# EAGLE board Electronica_4K1 (EAGLE 9.6.2)
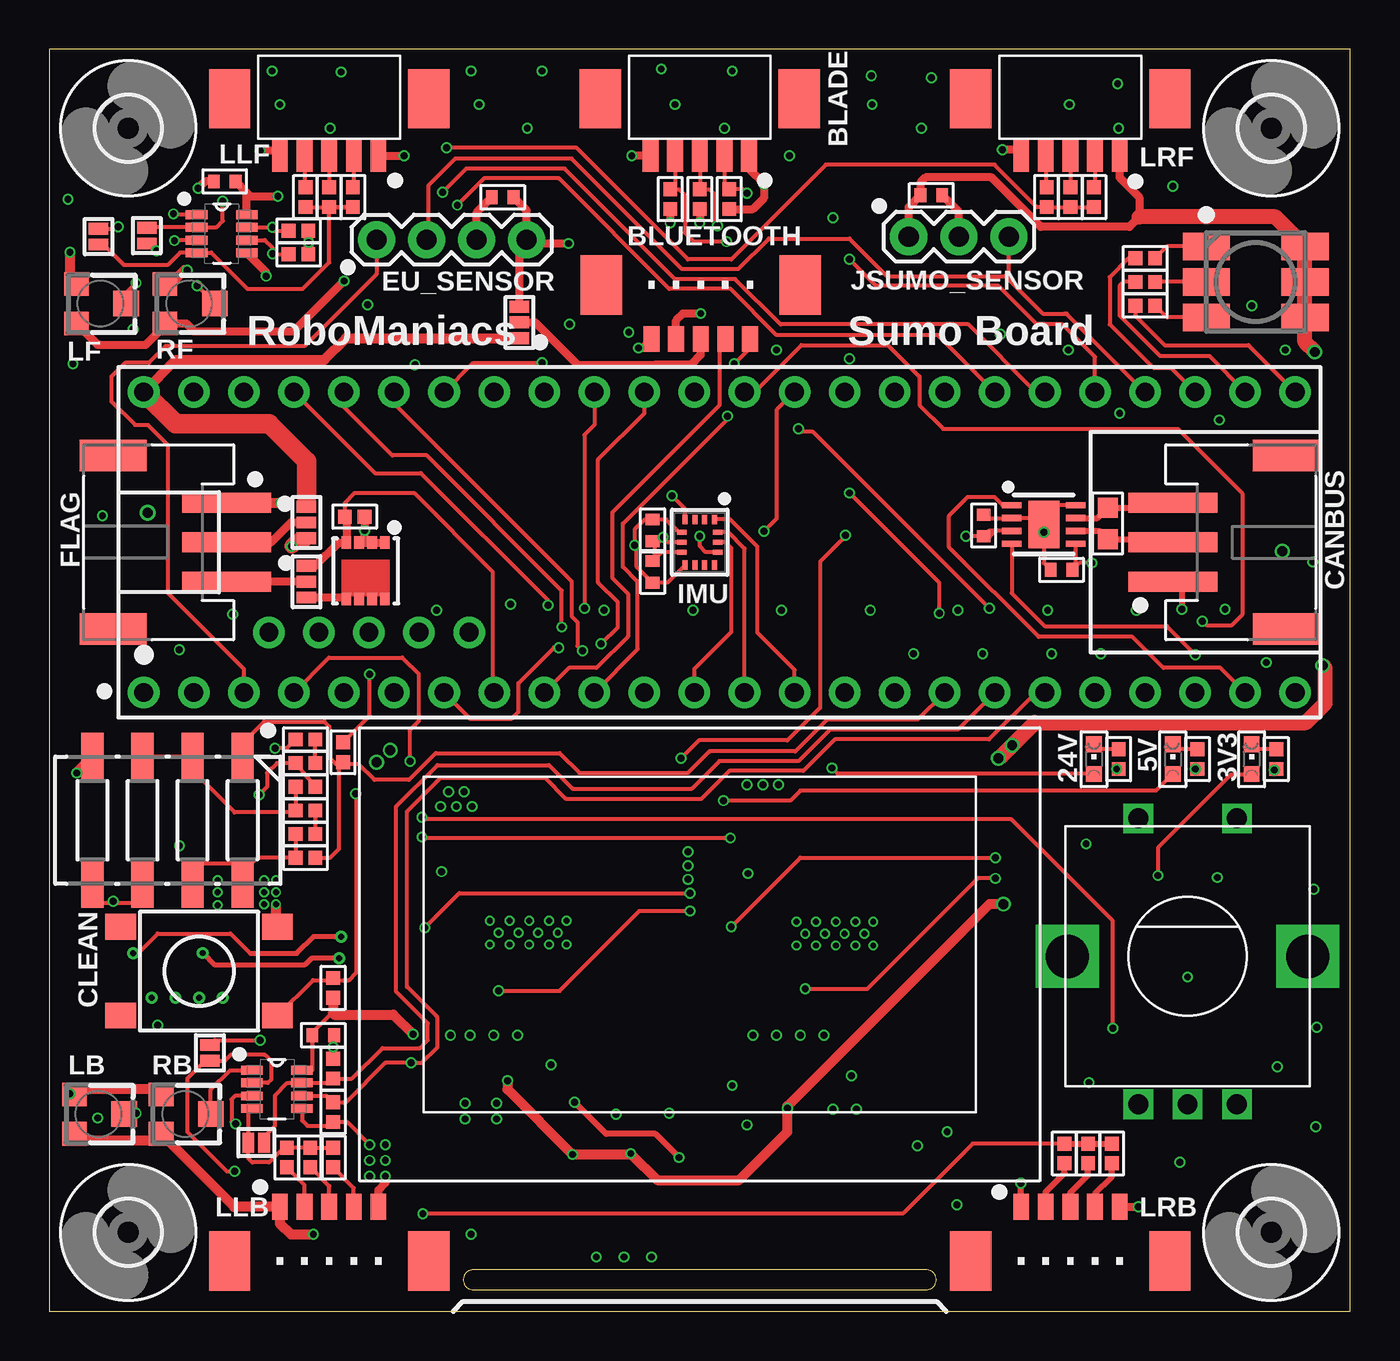
[diagram p5: board, top side]
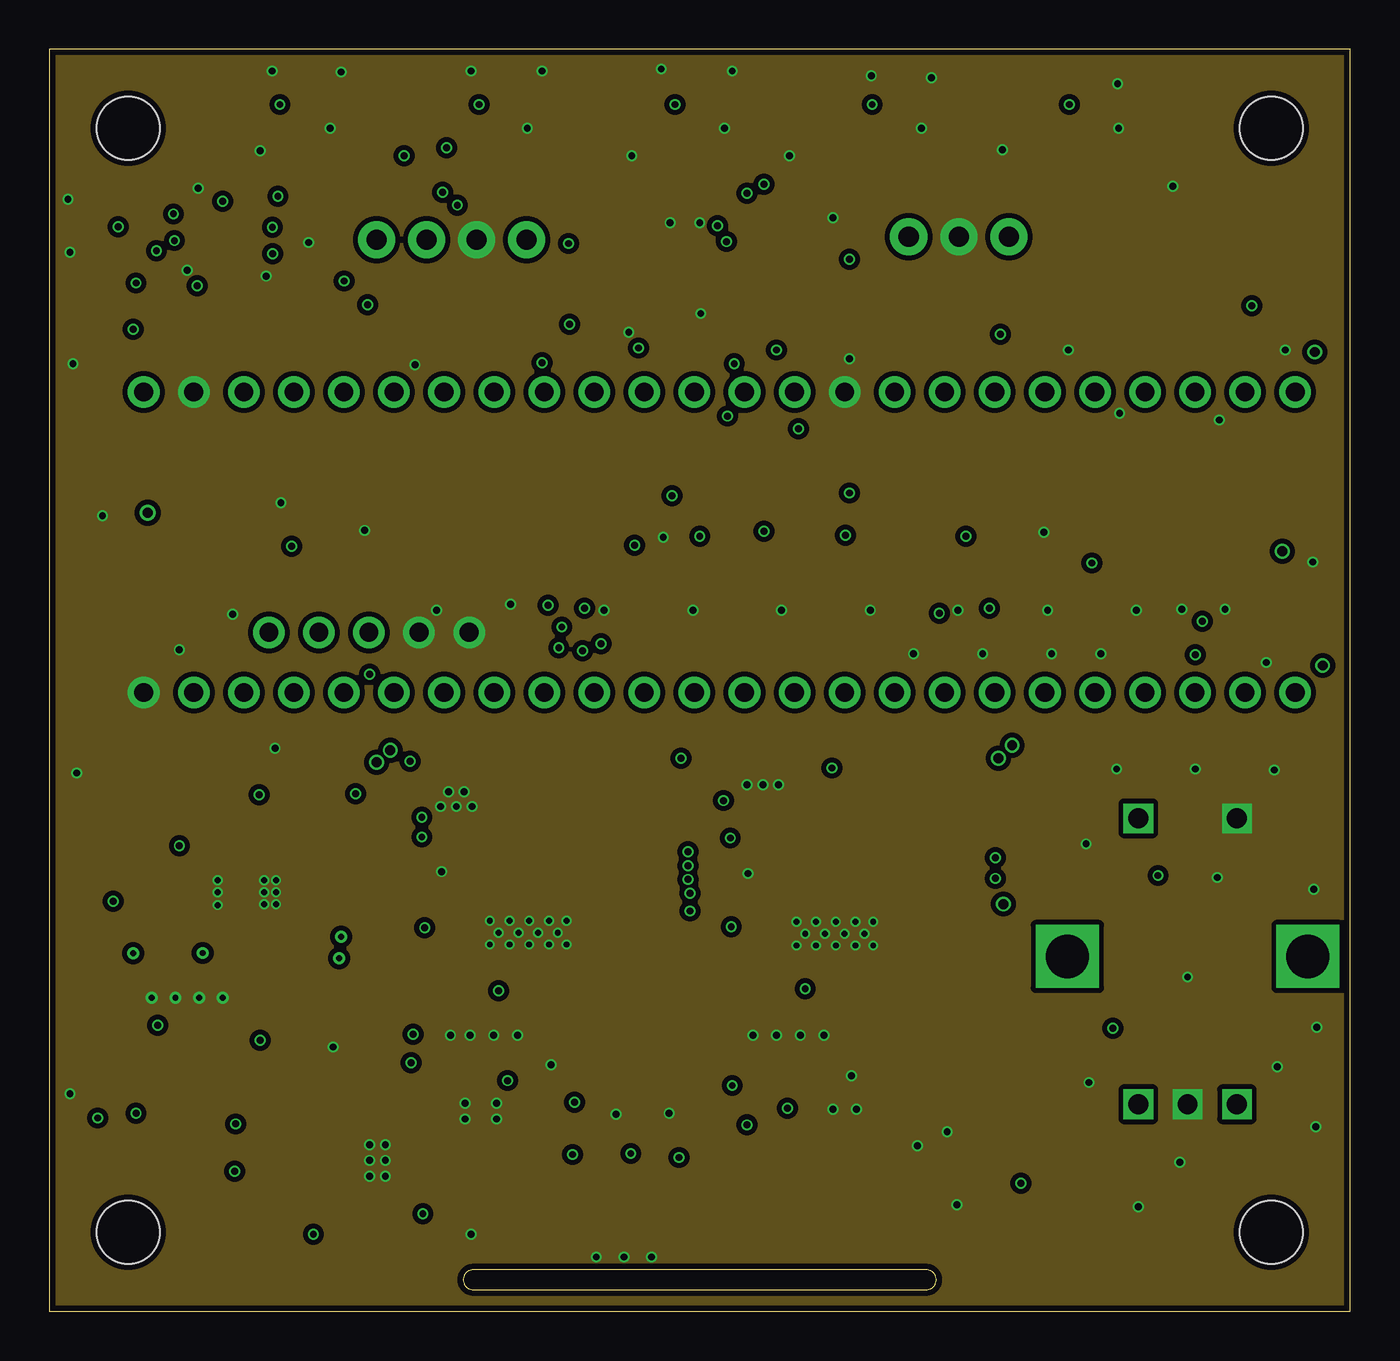
[diagram p6: board, inner layer Route2]
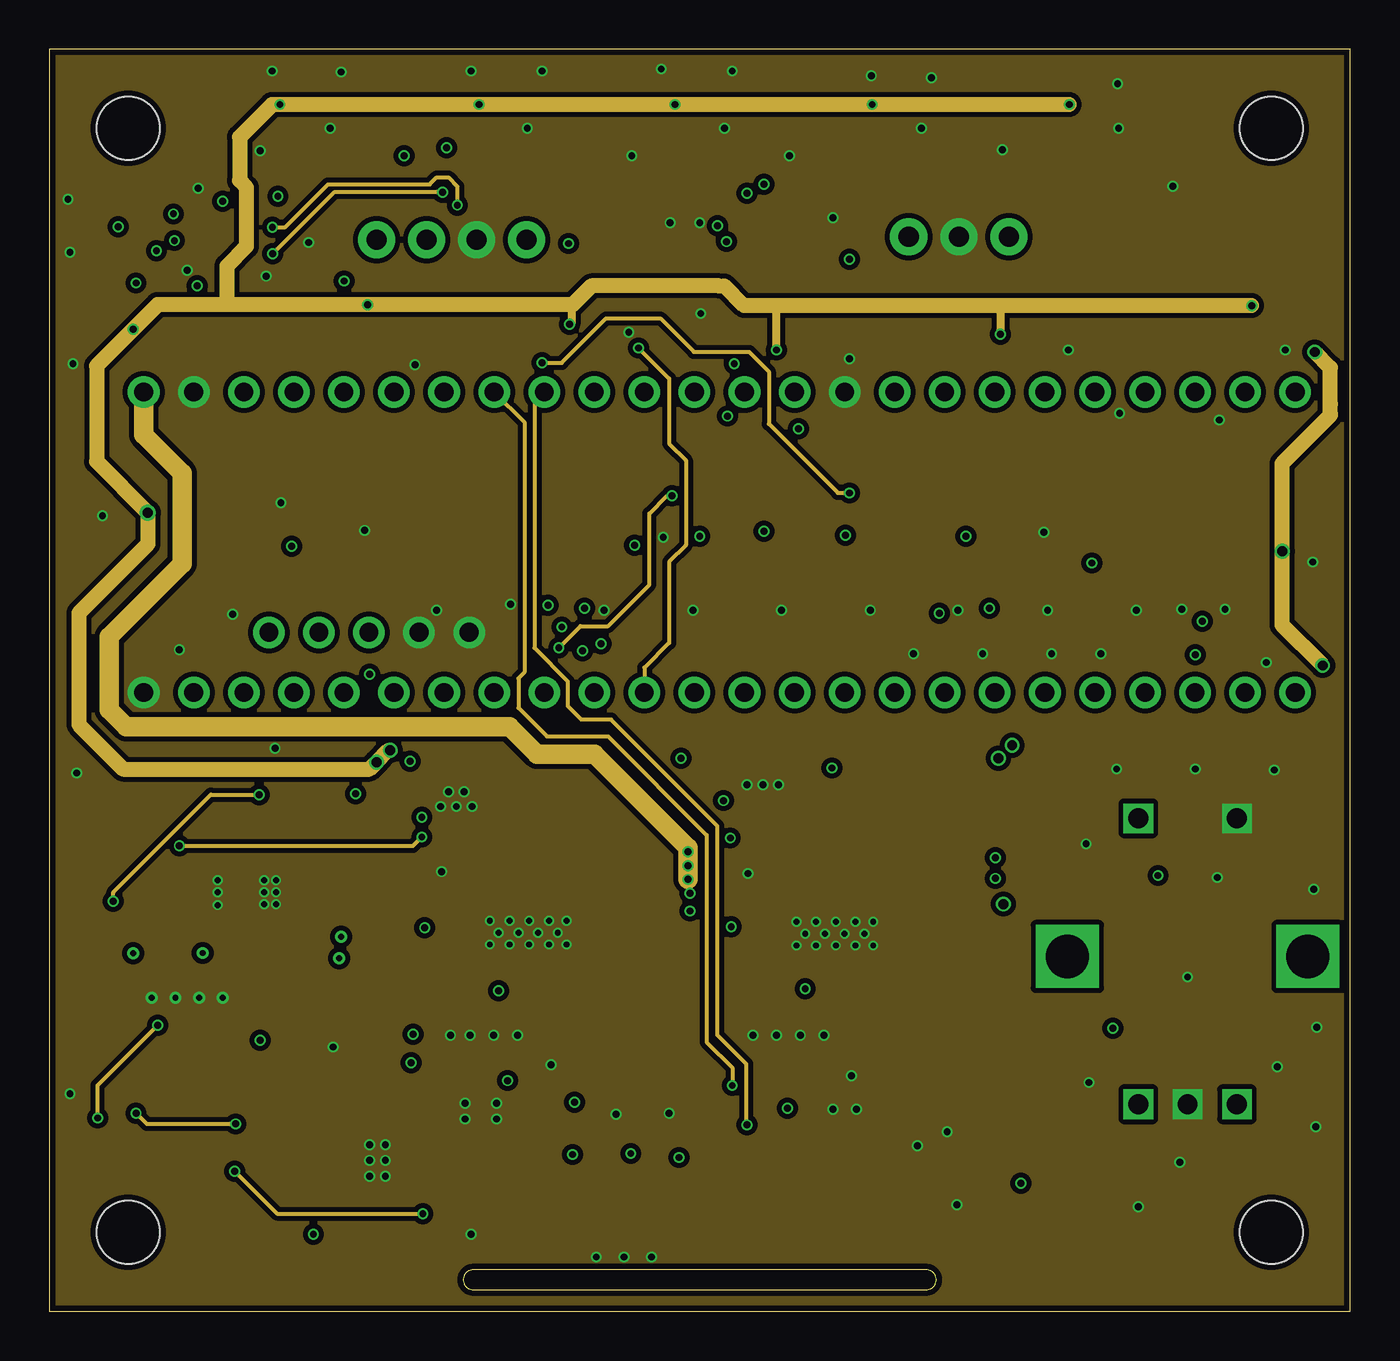
[diagram p7: board, inner layer Route15]
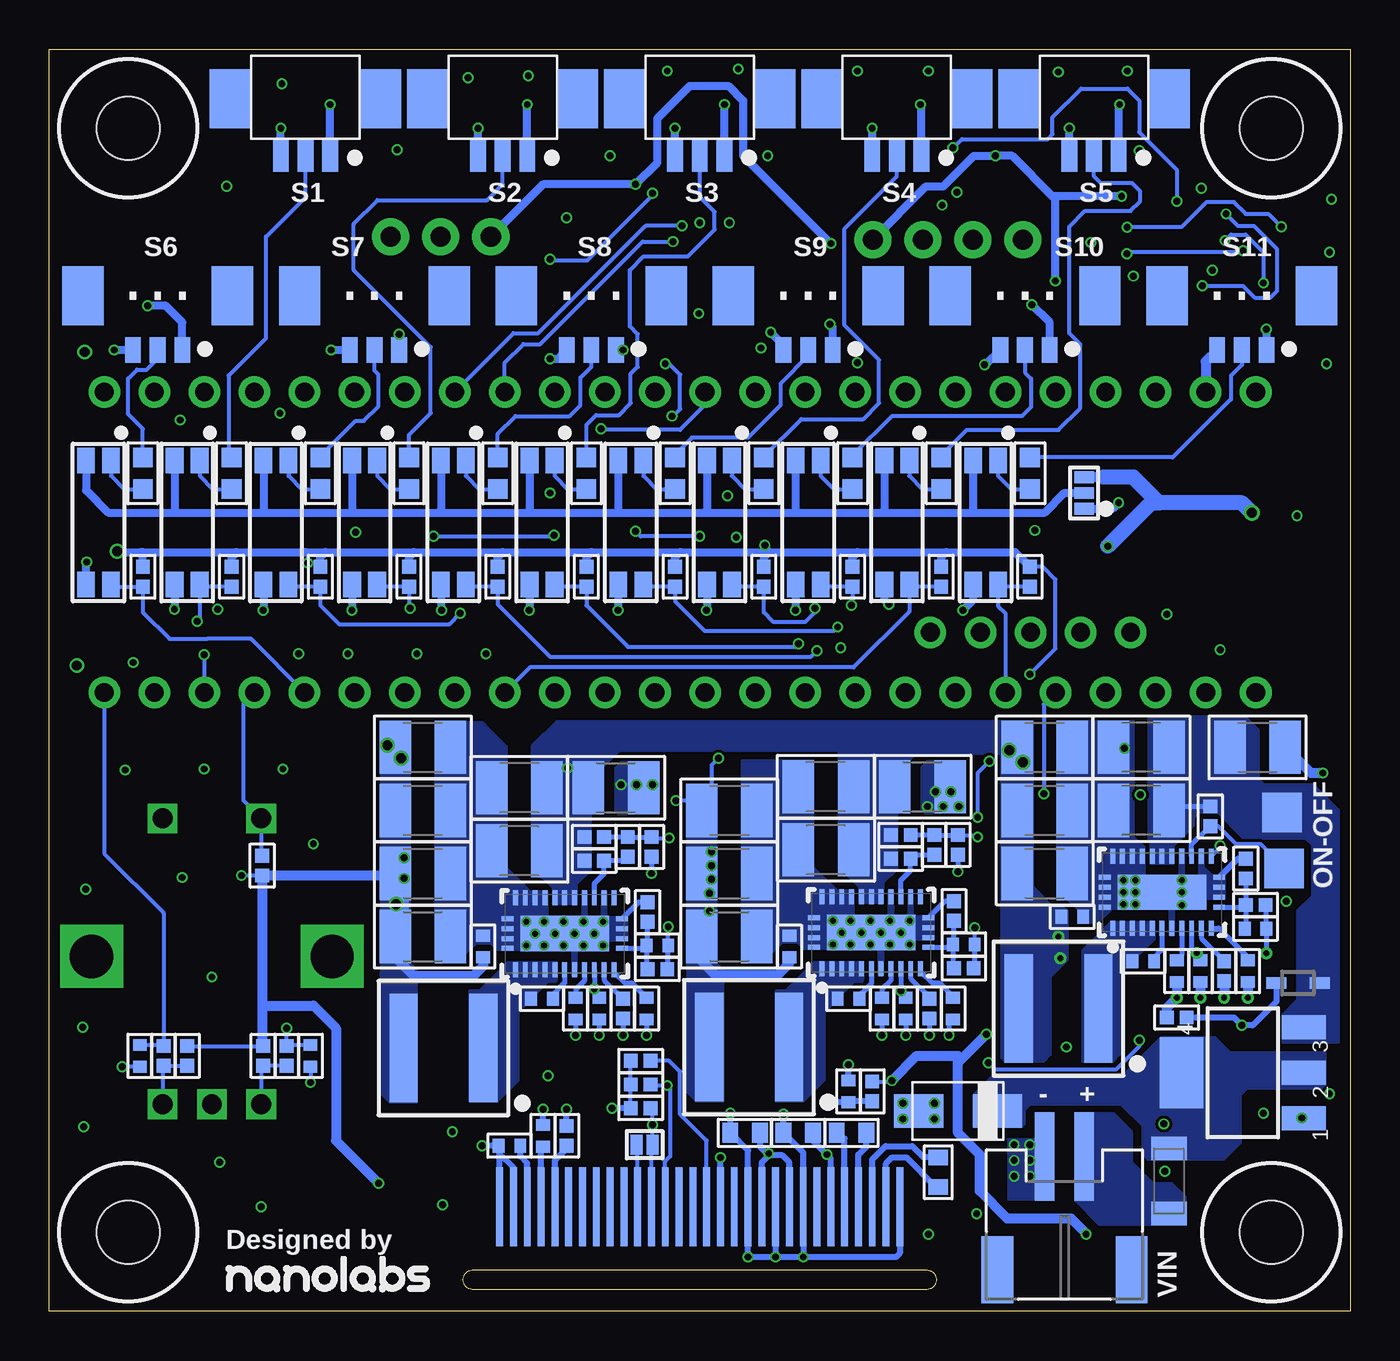
[diagram p8: board, bottom side, seen from below]

Size 66 x 64 mm. Coordinates in mm from the lower left corner, seen from the top.
Outline: 0,0 66,0 66,64 0,64 0,0
Copper layers (1+2*15+16): Top 0.035mm / dielectric 0.11mm / Route2 0.035mm / dielectric 1.2mm / Route15 0.035mm / dielectric 0.11mm / Bottom 0.035mm
Design rules "PCBWay_4L_152um-Track *": minimum track width 6mil, minimum drill 0.3mm, track to track 6mil, track to pad 6mil, pad to pad 6mil, via to via 6mil, smd to smd 0mil, copper to edge 0.3mm, drill to drill 10mil, minimum pad ring 6mil, minimum via ring 0.1mm, stop-mask expansion 2mil, vias tented up to drill 0.5mm, thermal gap 0.2mm
Net classes: 1 100R_DIFF: width 0.254 mm, drill 0.3 mm, clearance 0.254 mm

## Footprints (pad centres in the part's own frame; a part is rotated, then mirrored left to right if it is on the bottom)
C1210 = smd 1.6 x 2.7: 1 -1.4,0; 2 1.4,0
C0402_IPC = smd 0.6 x 0.7: 1 -0.55,0; 2 0.55,0
C0603 = smd 0.8 x 1: 1 -0.75,0; 2 0.75,0
FYLS-5050NRGBC = smd 2.4 x 1.4: 1 2.5,-1.8; 2 2.5,0; 3 2.5,1.8; 4 -2.5,1.8; 5 -2.5,0; 6 -2.5,-1.8
SMA = smd 2.5 x 1.7: A 2,0; C -2,0
SOD323 = smd 1 x 0.6: 1 -1.1,0; 2 1.1,0
3,2 = hole 3.2: 0,0
WQFN30_6X4MM = smd 0.75 x 0.25: 1 -1.825,2.5; 2 -1.825,2; 3 -1.825,1.5; 4 -1.825,1; 5 -1.825,0.5; 6 -1.825,0; 7 -1.825,-0.5; 8 -1.825,-1; 9 -1.825,-1.5; 10 -1.825,-2; 11 -1.825,-2.5; 16 1.825,-2.5; 17 1.825,-2; 18 1.825,-1.5; 19 1.825,-1; 20 1.825,-0.5; 21 1.825,0; 22 1.825,0.5; 23 1.825,1; 24 1.825,1.5; 25 1.825,2; 26 1.825,2.5 | smd 0.25 x 0.6: 12 -0.75,-2.9; 13 -0.25,-2.9; 14 0.75,-2.9; 15 0.25,-2.9; 27 0.25,2.9; 28 0.75,2.9; 29 -0.75,2.9; 30 -0.25,2.9 | smd 1.8 x 4.5: 31 0,0
LGA_BMI270 = smd 0.475 x 0.25: 1 -1.163,0.75; 2 -1.163,0.25; 3 -1.163,-0.25; 4 -1.163,-0.75; 8 1.163,-0.75; 9 1.163,-0.25; 10 1.163,0.25; 11 1.163,0.75 | smd 0.25 x 0.475: 5 -0.5,-0.912; 6 0,-0.912; 7 0.5,-0.912; 12 0,0.912; 13 0.5,0.912; 14 -0.5,0.912
PG-TSON-8 = smd 1 x 0.32: 1 -1.625,0.975; 2 -1.625,0.325; 3 -1.625,-0.325; 4 -1.625,-0.975; 5 1.625,-0.975; 6 1.625,-0.325; 7 1.625,0.325; 8 1.625,0.975 | smd 1.58 x 2.4: EP 0,0
PICOBLADE53261-0371 = smd 0.8 x 1.6: 1 -1.25,2.4; 2 0,2.4; 3 1.25,2.4 | smd 2.1 x 3: MOUNT@1 -3.8,-0.5; MOUNT@2 3.8,-0.5
PICOBLADE53398-0571 = smd 0.8 x 1.3: 1 -1.25,2.75; 2 0,2.75; 3 1.25,2.75 | smd 2.1 x 3: GND@1 3.8,0; GND@2 -3.8,0
PICOBLADE53398-0571' = smd 0.8 x 1.3: 1 -2.5,2.75; 2 -1.25,2.75; 3 0,2.75; 4 1.25,2.75; 5 2.5,2.75 | smd 2.1 x 3: GND@1 5.05,0; GND@2 -5.05,0
PICOBLADE53261-0571 = smd 0.8 x 1.6: 1 -2.4,2.4; 2 -1.15,2.4; 3 0.1,2.4; 4 1.35,2.4; 5 2.6,2.4 | smd 2.1 x 3: GND@1 -4.95,-0.5; GND@2 5.15,-0.5
1X04 = drill 1.016 pad 1.88: 1 0,0; 2 2.54,0; 3 5.08,0; 4 7.62,0
1X03 = drill 1.016 pad 1.88: 1 0,0; 2 2.54,0; 3 5.08,0
XAL6060 = smd 5.5 x 1.43: 1 0,2.02; 2 0,-2.02
CHIPLED_0603 = smd 0.8 x 0.8: A 0,-0.75; C 0,0.75
SOP-4 = smd 1.3 x 0.9: 1 -3.15,0.635; 2 -3.15,-0.635; 3 3.15,-0.635; 4 3.15,0.635
REX012864LWAP3N00000 = smd 0.35 x 4 bottom: 1 -10.15,-12.8; 2 -9.45,-12.8; 3 -8.75,-12.8; 4 -8.05,-12.8; 5 -7.35,-12.8; 6 -6.65,-12.8; 7 -5.95,-12.8; 8 -5.25,-12.8; 9 -4.55,-12.8; 10 -3.85,-12.8; 11 -3.15,-12.8; 12 -2.45,-12.8; 13 -1.75,-12.8; 14 -1.05,-12.8; 15 -0.35,-12.8; 16 0.35,-12.8; 17 1.05,-12.8; 18 1.75,-12.8; 19 2.45,-12.8; 20 3.15,-12.8; 21 3.85,-12.8; 22 4.55,-12.8; 23 5.25,-12.8; 24 5.95,-12.8; 25 6.65,-12.8; 26 7.35,-12.8; 27 8.05,-12.8; 28 8.75,-12.8; 29 9.45,-12.8; 30 10.15,-12.8
VSON-3X3 = smd 0.5 x 0.63: 1 -0.975,-1.435; 2 -0.325,-1.435; 3 0.325,-1.435; 5 0.975,1.435; 6 0.325,1.435; 7 -0.325,1.435; 8 -0.975,1.435 | smd 0.47 x 0.63: 4 0.975,-1.435
SOT223 = smd 1.219 x 2.235: 1 -2.311,-3.099; 2 0,-3.099; 3 2.311,-3.099 | smd 3.6 x 2.2: 4 0,3.099
R0402_IPC = smd 0.7 x 0.7: 1 -0.5,0; 2 0.5,0
R0603 = smd 1 x 1: 1 -0.8,0; 2 0.8,0
RTRIM3103 = smd 1.2 x 1.25: 1 -1,-1.225; 3 1,-1.225 | smd 1.3 x 1.3: 2 0,1.3
CT/CN1206 = smd 1.2 x 1.8: 1 -1.65,0; 2 1.65,0
CTS-219-04J = smd 1.13 x 2.44: 1 -3.81,-3.215; 2 -1.27,-3.215; 3 1.27,-3.215; 4 3.81,-3.215; 5 3.81,3.215; 6 1.27,3.215; 7 -1.27,3.215; 8 -3.81,3.215
SJ2W_1X1.5_NO = smd 0.6 x 1: 1 -0.8,0; 2 0,0; 3 0.8,0
SJ_1X1.5_NO = smd 0.6 x 1: 1 -0.4,0; 2 0.4,0
ALPS_EC12E_SW = drill 1 square: A -2.5,-7.5; B 2.5,-7.5; C 0,-7.5; D -2.5,7; E 2.5,7 | drill 2.2 square: GND1 -6.1,0; GND2 6.1,0
TACTILE_SWITCH_SMD_6.2MM_TALL = smd 1.55 x 1.3: A1 -3.975,-2.25; A2 3.975,-2.25; B1 -3.975,2.25; B2 3.975,2.25
TP20SQ = smd 2 x 2: TP 0,0
TEENSY4.1 = drill 0.95 pad 1.6: 1 -29.21,-7.62; 2 -26.67,-7.62; 3 -24.13,-7.62; 4 -21.59,-7.62; 5 -19.05,-7.62; 6 -16.51,-7.62; 7 -13.97,-7.62; 8 -11.43,-7.62; 9 -8.89,-7.62; 10 -6.35,-7.62; 11 -3.81,-7.62; 12 -1.27,-7.62; 13 1.27,-7.62; 14 3.81,-7.62; 15 6.35,-7.62; 16 8.89,-7.62; 17 11.43,-7.62; 18 13.97,-7.62; 19 16.51,-7.62; 20 19.05,-7.62; 21 21.59,-7.62; 22 24.13,-7.62; 23 26.67,-7.62; 24 29.21,-7.62; 25 29.21,7.62; 26 26.67,7.62; 27 24.13,7.62; 28 21.59,7.62; 29 19.05,7.62; 30 16.51,7.62; 31 13.97,7.62; 32 11.43,7.62; 33 8.89,7.62; 34 6.35,7.62; 35 3.81,7.62; 36 1.27,7.62; 37 -1.27,7.62; 38 -3.81,7.62; 39 -6.35,7.62; 40 -8.89,7.62; 41 -11.43,7.62; 42 -13.97,7.62; 43 -16.51,7.62; 44 -19.05,7.62; 45 -21.59,7.62; 46 -24.13,7.62; 47 -26.67,7.62; 48 -29.21,7.62; 49 -22.86,-4.57; 50 -20.32,-4.57; 51 -17.78,-4.57; 52 -15.24,-4.57; 53 -12.7,-4.57
SOT65P280X145-8N = smd 1.1 x 0.45: 1 -1.27,0.965; 2 -1.27,0.33; 3 -1.27,-0.33; 4 -1.27,-0.965; 5 1.27,-0.965; 6 1.27,-0.33; 7 1.27,0.33; 8 1.27,0.965
S3B-PH-SM4-TB = smd 1 x 4.5: 1 2,0; 2 0,0; 3 -2,0 | smd 1.6 x 3.4: M1 4.4,5.75; M2 -4.4,5.75
S2B-PH-SM4-TB = smd 1 x 4.5: 1 1,0; 2 -1,0 | smd 1.6 x 3.4: M1 3.4,5.75; M2 -3.4,5.75

## Placement (x,y rotation side)
C1  4.7uF  [C1210]  10.6,25.4 180 bottom
C2  4.7uF  [C1210]  10.6,28.6 180 bottom
C3  4.7uF  [C1210]  4.7,28.6 0 bottom
C4  2.2uF  [C0402_IPC]  8.8,17.25 270 bottom
C5  DNM  [C0402_IPC]  5.2,17.25 270 bottom
C6  470nF  [C0402_IPC]  10.5,17.75 0 bottom
C7  DNM  [C0402_IPC]  4.8,19.4 180 bottom
C8  1uF  [C0402_IPC]  7.6,17.25 270 bottom
C9  22uF  [C1210]  15.5,22.2 0 bottom
C10  22uF  [C1210]  15.5,25.4 0 bottom
C11  22uF  [C1210]  15.5,28.6 0 bottom
C12  100nF  [C0402_IPC]  14.1,20 0 bottom
C13  4.7uF  [C1210]  26.6,23.4 180 bottom
C14  4.7uF  [C1210]  26.6,26.6 180 bottom
C15  4.7uF  [C1210]  21.7,26.6 0 bottom
C16  2.2uF  [C0402_IPC]  23.75,15.35 270 bottom
C17  DNM  [C0402_IPC]  20.15,15.35 270 bottom
C18  470nF  [C0402_IPC]  25.45,15.85 0 bottom
C19  DNM  [C0402_IPC]  19.6,18.6 180 bottom
C20  1uF  [C0402_IPC]  22.55,15.35 270 bottom
C21  22uF  [C1210]  31.5,19 0 bottom
C22  22uF  [C1210]  31.5,22.2 0 bottom
C23  22uF  [C1210]  31.5,25.4 0 bottom
C24  100nF  [C0402_IPC]  28.45,18.5 90 bottom
C25  4.7uF  [C1210]  42.15,23.35 180 bottom
C26  4.7uF  [C1210]  42.15,26.55 180 bottom
C27  4.7uF  [C1210]  37.25,26.55 0 bottom
C28  2.2uF  [C0402_IPC]  39.3,15.35 270 bottom
C29  DNM  [C0402_IPC]  35.7,15.35 270 bottom
C30  470nF  [C0402_IPC]  41,15.85 0 bottom
C31  DNM  [C0402_IPC]  35.15,18.55 180 bottom
C32  1uF  [C0402_IPC]  38.1,15.35 270 bottom
C33  22uF  [C1210]  47.05,22.2 0 bottom
C34  22uF  [C1210]  47.05,25.4 0 bottom
C35  22uF  [C1210]  47.05,19 0 bottom
C36  100nF  [C0402_IPC]  44,18.5 90 bottom
C37  22uF  [C1210]  47.05,28.6 0 bottom
C38  2.2uF  [C0402_IPC]  13.9,14 0 top
C39  2.2uF  [C0402_IPC]  8.9,57.3 180 top
C40  220nF  [C0402_IPC]  40.95,8.9 90 bottom
C41  220nF  [C0402_IPC]  42.65,8.4 180 bottom
C42  4.7uF  [C0603]  30.7,9.05 180 bottom
C43  4.7uF  [C0603]  28,9.05 180 bottom
C44  4.7uF  [C0603]  25.3,9.05 0 bottom
C45  4.7uF  [C0603]  20.9,7.05 270 bottom
C46  1uF  [C0402_IPC]  51.35,37.6 180 top
C47  1uF  [C0402_IPC]  47.4,39.85 90 top
C48  2.2uF  [C0402_IPC]  23,56.5 180 top
C49  2.2uF  [C0402_IPC]  44.75,56.6 0 top
C50  100nF  [C0402_IPC]  52.75,12.95 270 bottom
C51  100nF  [C0402_IPC]  61.4,12.95 270 bottom
C52  100nF  [C0402_IPC]  30.6,39.6 270 top
C53  100nF  [C0402_IPC]  30.6,37.5 90 top
C55  1uF  [C0402_IPC]  25.45,11.15 90 bottom
D1  FYLS-5050NRGBC  [FYLS-5050NRGBC]  61.2,52.2 180 top
D2  SMAJ58CA  [SMA]  19.9,10.15 180 bottom
D3  MM3Z10-DIO  [SOD323]  2.65,16.65 180 bottom
H1  MOUNT-HOLE3.2  [3,2]  4,4 0 top
H2  MOUNT-HOLE3.2  [3,2]  62,4 0 top
H3  MOUNT-HOLE3.2  [3,2]  4,60 0 top
H4  MOUNT-HOLE3.2  [3,2]  62,60 0 top
IC1  LM76003QRNPTQ1  [WQFN30_6X4MM]  9.55,21.25 90 bottom
IC2  LM76003QRNPTQ1  [WQFN30_6X4MM]  24.3,19.2 90 bottom
IC3  LM76003QRNPTQ1  [WQFN30_6X4MM]  39.85,19.15 90 bottom
IC4  BMI270  [LGA_BMI270]  33,39 270 top
IC6  TLE9250  [PG-TSON-8]  50.45,39.9 0 top
J1  05326103713  [PICOBLADE53261-0371]  53,61 180 bottom
J2  05326103713  [PICOBLADE53261-0371]  43,61 180 bottom
J3  05326103713  [PICOBLADE53261-0371]  33,61 180 bottom
J4  05326103713  [PICOBLADE53261-0371]  23,61 180 bottom
J5  05326103713  [PICOBLADE53261-0371]  13,61 180 bottom
J6  0533980371  [PICOBLADE53398-0571]  60.5,51.5 180 bottom
J7  0533980371  [PICOBLADE53398-0571]  49.5,51.5 180 bottom
J8  0533980371  [PICOBLADE53398-0571]  38.5,51.5 180 bottom
J9  0533980371  [PICOBLADE53398-0571]  27.5,51.5 180 bottom
J10  0533980371  [PICOBLADE53398-0571]  16.5,51.5 180 bottom
J11  0533980371  [PICOBLADE53398-0571]  5.5,51.5 180 bottom
J12  0533980571  [PICOBLADE53398-0571']  51.8,2.55 0 top
J13  0533980571  [PICOBLADE53398-0571']  14.2,2.55 0 top
J14  0532610571  [PICOBLADE53261-0571]  51.9,61 180 top
J15  0532610571  [PICOBLADE53261-0571]  14.3,61 180 top
J16  [1X04]  16.6,54.35 0 top
J17  [1X03]  43.6,54.5 0 top
J18  0532610571  [PICOBLADE53261-0571]  33.1,61 180 top
J19  0533980571  [PICOBLADE53398-0571']  33.05,52.05 180 top
L1  15uH  [XAL6060]  14.8,15.35 270 bottom
L2  3.3uH  [XAL6060]  30.5,13.4 270 bottom
L3  2.2uH  [XAL6060]  46,13.35 270 bottom
LED1  GREEN  [CHIPLED_0603]  53,28 0 top
LED2  GREEN  [CHIPLED_0603]  57,28 0 top
LED3  GREEN  [CHIPLED_0603]  61,28 0 top
OK1  TCMT1600  [SOP-4]  59,40 270 bottom
OK2  TCMT1600  [SOP-4]  50,40 270 bottom
OK3  TCMT1600  [SOP-4]  41,40 270 bottom
OK4  TCMT1600  [SOP-4]  32,40 270 bottom
OK5  TCMT1600  [SOP-4]  23,40 270 bottom
OK6  TCMT1600  [SOP-4]  63.5,40 270 bottom
OK7  TCMT1600  [SOP-4]  54.5,40 270 bottom
OK8  TCMT1600  [SOP-4]  45.5,40 270 bottom
OK9  TCMT1600  [SOP-4]  36.5,40 270 bottom
OK10  TCMT1600  [SOP-4]  27.5,40 270 bottom
OK11  TCMT1600  [SOP-4]  18.5,40 270 bottom
OLED1  REX012864LWAP3N00000  [REX012864LWAP3N00000]  33,18.1 0 top
Q1  CSD17308Q3  [VSON-3X3]  16.05,37.55 180 top
Q2  ZXMP10A18GTA  [SOT223]  5.45,12.1 90 bottom
R1  0R  [R0402_IPC]  7.1,25.1 270 bottom
R2  39k  [R0402_IPC]  6.4,17.25 90 bottom
R3  100k  [R0402_IPC]  4.8,20.6 0 bottom
R4  4.42K  [R0402_IPC]  5.3,22.45 270 bottom
R5  DNM  [R0402_IPC]  22.8,22.95 0 bottom
R6  39k  [R0402_IPC]  21.35,15.35 90 bottom
R7  100k  [R0402_IPC]  19.6,17.4 0 bottom
R8  24.9k  [R0402_IPC]  20.1,20.3 270 bottom
R9  DNM  [R0402_IPC]  38.35,22.85 0 bottom
R10  39k  [R0402_IPC]  36.9,15.35 90 bottom
R11  100k  [R0402_IPC]  35.15,17.35 0 bottom
R12  43.7k  [R0402_IPC]  35.65,20.25 270 bottom
R13  TBD  [R0402_IPC]  54.25,28 90 top
R14  TBD  [R0402_IPC]  58.25,28 90 top
R15  TBD  [R0402_IPC]  62.25,28 90 top
R16  4.7k  [R0402_IPC]  56.75,37.25 270 bottom
R17  10k  [R0603]  56.75,42.5 90 bottom
R18  4.7k  [R0402_IPC]  47.75,37.25 270 bottom
R19  10k  [R0603]  47.75,42.5 90 bottom
R20  4.7k  [R0402_IPC]  38.75,37.25 270 bottom
R21  10k  [R0603]  38.75,42.5 90 bottom
R22  4.7k  [R0402_IPC]  29.75,37.25 270 bottom
R23  10k  [R0603]  29.75,42.5 90 bottom
R24  4.7k  [R0402_IPC]  20.75,37.25 270 bottom
R25  10k  [R0603]  20.75,42.5 90 bottom
R26  4.7k  [R0402_IPC]  16.25,37.25 270 bottom
R27  10k  [R0603]  16.25,42.5 90 bottom
R28  4.7k  [R0402_IPC]  61.25,37.25 270 bottom
R29  10k  [R0603]  61.25,42.5 90 bottom
R30  4.7k  [R0402_IPC]  52.25,37.25 270 bottom
R31  10k  [R0603]  52.25,42.5 90 bottom
R32  4.7k  [R0402_IPC]  43.25,37.25 270 bottom
R33  10k  [R0603]  43.25,42.5 90 bottom
R34  4.7k  [R0402_IPC]  34.25,37.25 270 bottom
R35  10k  [R0603]  34.25,42.5 90 bottom
R36  4.7k  [R0402_IPC]  25.25,37.25 270 bottom
R37  10k  [R0603]  25.25,42.5 90 bottom
R38  3305SMD-10K  [RTRIM3103]  6.9,10 270 top
R39  3305SMD-10K  [RTRIM3103]  2.5,10 270 top
R40  4.7k  [R0402_IPC]  14.4,10.1 270 top
R41  4.7k  [R0402_IPC]  14.4,12.3 90 top
R42  4.7k  [R0402_IPC]  53.9,8 90 top
R43  4.7k  [R0402_IPC]  52.7,8 90 top
R44  4.7k  [R0402_IPC]  51.5,8 90 top
R45  4.7k  [R0402_IPC]  12.05,7.8 90 top
R46  4.7k  [R0402_IPC]  13.25,7.8 90 top
R47  4.7k  [R0402_IPC]  14.4,7.8 90 top
R48  3305SMD-10K  [RTRIM3103]  7.1,51.1 270 top
R49  3305SMD-10K  [RTRIM3103]  2.6,51.1 270 top
R50  4.7k  [R0402_IPC]  12.65,53.6 0 top
R51  4.7k  [R0402_IPC]  12.65,54.8 0 top
R52  4.7k  [R0402_IPC]  50.6,56.5 270 top
R53  4.7k  [R0402_IPC]  51.8,56.5 270 top
R54  4.7k  [R0402_IPC]  53,56.5 270 top
R55  4.7k  [R0402_IPC]  15.4,56.5 270 top
R56  4.7k  [R0402_IPC]  14.2,56.5 270 top
R57  4.7k  [R0402_IPC]  13,56.5 270 top
R58  310k  [R0402_IPC]  39.75,8.9 270 bottom
R59  120R  [R0603]  53.7,39.95 90 top
R60  4.7k  [R0402_IPC]  14.4,16.4 90 top
R61  1k  [R0402_IPC]  55.6,51 0 top
R62  1k  [R0402_IPC]  55.6,52.2 0 top
R63  1k  [R0402_IPC]  55.6,53.4 0 top
R64  4.7k  [R0402_IPC]  14.9,28.35 270 top
R65  1k  [R0402_IPC]  13,23 180 top
R66  1k  [R0402_IPC]  13,24.2 180 top
R67  3.92k  [R0402_IPC]  13,26.6 0 top
R68  4.7k  [R0402_IPC]  55.2,22.6 90 bottom
R69  4.7k  [R0402_IPC]  55.15,12.95 270 bottom
R70  4.7k  [R0402_IPC]  59,12.95 270 bottom
R71  1k  [R0402_IPC]  53.95,12.95 270 bottom
R72  1k  [R0402_IPC]  60.2,12.95 270 bottom
R73  100k  [R0402_IPC]  15.5,40.3 180 top
R74  2A 125V  [CT/CN1206]  9.2,6.6 270 bottom
R75  4.7k  [R0402_IPC]  34.5,56.4 90 top
R76  TBD  [R0402_IPC]  31.5,56.4 90 top
R77  TBD  [R0402_IPC]  33,56.4 90 top
R78  100k  [R0402_IPC]  8.8,14.9 0 bottom
R79  3.92k  [R0402_IPC]  13,27.8 0 top
R80  1k  [R0402_IPC]  13,25.4 180 top
R81  3.92k  [R0402_IPC]  13,29 0 top
R82  4.7k  [R0402_IPC]  36,12.7 0 bottom
R83  4.7k  [R0402_IPC]  24.25,11.15 270 bottom
R84  4.7k  [R0402_IPC]  36,10.3 0 bottom
R85  4.7k  [R0402_IPC]  36,11.5 0 bottom
R86  39k  [R0402_IPC]  22.8,24.15 180 bottom
R87  39k  [R0402_IPC]  19.9,23.65 90 bottom
R88  0R  [R0402_IPC]  21.1,23.65 270 bottom
R89  39k  [R0402_IPC]  38.35,24.05 180 bottom
R90  39k  [R0402_IPC]  35.45,23.55 90 bottom
R91  0R  [R0402_IPC]  36.65,23.55 270 bottom
S1  219-04J  [CTS-219-04J]  6,24.9 180 top
SJ1  SJ2W  [SJ2W_1X1.5_NO]  13.5,41.5 90 bottom
SJ2  SJ2W  [SJ2W_1X1.5_NO]  23.85,50.15 90 top
SJ3  SJ2W  [SJ2W_1X1.5_NO]  13.05,37 270 top
SJ4  SJ_1.5X1_NO  [SJ_1X1.5_NO]  35.8,8.45 180 bottom
SJ5  SJ2W  [SJ2W_1X1.5_NO]  13.05,40 270 top
SJ7  SJ_1.5X1_NO  [SJ_1X1.5_NO]  2.5,54.5 90 top
SJ8  SJ_1.5X1_NO  [SJ_1X1.5_NO]  4.95,54.55 270 top
SJ9  SJ_1.5X1_NO  [SJ_1X1.5_NO]  10.5,8.55 0 top
SJ10  SJ_1.5X1_NO  [SJ_1X1.5_NO]  8.15,13.1 90 top
SW1  EC12E_SW  [ALPS_EC12E_SW]  57.75,18 0 top
SW3  6x6MM  [TACTILE_SWITCH_SMD_6.2MM_TALL]  7.6,17.25 0 top
TP1  TPTP20SQ  [TP20SQ]  3.45,25.3 90 bottom
TP2  TPTP20SQ  [TP20SQ]  3.35,22.45 90 bottom
U1  TEENSY4.1  [TEENSY4.1]  34,39 0 top
U2  TLV3502AQDCNRQ1  [SOT65P280X145-8N]  11.55,11.25 0 top
U3  TLV3502AQDCNRQ1  [SOT65P280X145-8N]  8.75,54.65 0 top
U$1  [NANOLABS10]  57.1,0.9 0 bottom
X1  S3B-PH-SM4-TB  [S3B-PH-SM4-TB]  9,39 90 top
X2  S3B-PH-SM4-TB  [S3B-PH-SM4-TB]  57,39 270 top
X3  S2B-PH-SM4-TB  [S2B-PH-SM4-TB]  14.5,7.85 180 bottom

## Tracks (layer width: path | path; a pad name or v marks a point on that pad's centre or on a via)
+3V3  (via drill 0.35, 0.5)
  Top 0.2: C46.1 52.08,37.77 | 52.08,37.77 IC6.5 | v52.9,37.95 52.25,37.95 52.08,37.77 | IC4.8 31.36,36.95 C53.1 29.8,37.75 29.8,38.75 v29.7,38.85 29.7,39.65 30.2,40.15 C52.1 31.3,40.15 31.95,39.5 IC4.5 | v48,23 38.1,23 v34.6,19.5 | v38.35,16.35 41.5,16.35 47.1,21.95 v48,21.95 | LED3.A 60.95,27.2 59.95,27.2 56.25,23.5 v56.25,22.1 | U2.8 13.32,12.21 13.35,12.24 C38.1 13.35,14.15 14.25,15.05 14.45,15.05 | R64.1 16.25,30.2 v16.25,32.3 | R48.3 5.88,50 5.62,49.75
  Top 0.3: J12.1 v49.3,6.5 | v29.5,8 29.48,7.97 30.8,6.65 35,6.65
  Top 0.4: J16.4 24.22,55.83 C48.1 | J17.1 43.6,56 C49.1 44.2,57.25 44.45,57.5 47.8,57.5 50.3,55 54.8,55 55.3,55.5 55.3,56.5 54.3,57.5 J14.1 | 63.7,53.5 D1.6 | J18.1 35.5,57.95 36.3,57.15 v36.25,57.15 36.25,56.45 35.7,55.9 R75.1 | J15.1 v18,58.6 | v26.35,54.15 24.42,54.15 J16.4 | U3.8 10.02,56.73 | C39.1 10.02,56.73 | 5.62,49.75 4.88,49 2.48,49 R49.3 | 10.02,56.73 10.2,56.55 v11.6,56.55 | v14.95,52.25 12.4,49.7 7.35,49.7 6.95,50.1 R48.3 | SJ2.3 23.85,53.98 J16.4
  Top 0.5: v48.4,20.65 47.7,20.65 37.45,10.4 v37.45,10.3 37.45,9.1 35,6.65 30.85,6.65 v29.5,8 | v13.4,3.9 12.25,3.9 11.7,4.45 J13.1 9.38,5.3 R38.3 5.33,8.65 1.62,8.65 R39.3 | R60.1 14.4,15.1 14.45,15.05 17.45,15.05 v18.45,14.05 | v23.25,11.7 23.25,11.25 v26.55,7.95 26.57,7.97 29.48,7.97
  Top 0.75: v64.6,32.75 64.72,32.62 64.72,30.82 63.75,29.85 50,29.85 v48.85,28.7 48.2,28.05 v48.15,28.05 | v64.2,48.65 63.7,49.15 D1.4 D1.5 63.7,53.5 | D1.6 62.2,55.5 55.3,55.5
  Route15 0.75: v64.6,32.75 62.55,34.8 v62.55,38.55 62.55,43 65,45.45 65,45.5 65,46 65,47.85 v64.2,48.65
  Bottom 0.2: 53,38.5 52.9,38.4 v52.9,37.95 | R70.1 R69.1 | v56.25,22.1 R68.1 | 29.5,38.5 29.5,38.65 v29.7,38.85 | R84.1 R85.1 R82.1 | R83.1 23.3,11.65 v23.25,11.7 | C31.1 v34.6,19.5 | 38.35,16.5 v38.35,16.35 | R26.1 15.6,37.75 14.95,37.1 14.95,33.6 v16.25,32.3
  Bottom 0.25: IC3.9 38.35,16.5 | v38.35,16.35 38.35,16.15 C32.1 | R11.2 34.6,17.4 C31.1
  Bottom 0.3: 48.45,18.05 C35.1 | OLED1.6 26.35,7.75 v26.55,7.95 27.25,8.65 C43.1 | OLED1.9 28.45,7.55 28.8,7.9 29.5,7.9 | C42.1 29.95,8.35 29.6,8 | OLED1.11 29.85,7.55 29.5,7.9 | 29.6,8 29.5,7.9 | 29.6,8 v29.5,8 | R84.1 v37.45,10.3
  Bottom 0.4: 56.5,38.5 61.25,38.5 R28.1 61.25,38.4 61.35,38.5 62.5,38.5 v62.55,38.55 | 56.5,38.5 53,38.5 52,38.5 | 52,38.5 47.5,38.5 | 47.5,38.5 43,38.5 | 43,38.5 38.5,38.5 | 38.5,38.5 34,38.5 | 34,38.5 29.5,38.5 | 29.5,38.5 25,38.5 | 25,38.5 20.5,38.5 | 20.5,38.5 17,38.5 R26.1 | R16.1 56.75,38.25 56.5,38.5 | R30.1 52.25,38.25 52,38.5 | R18.1 47.75,38.25 47.5,38.5 | R32.1 43.25,38.25 43,38.5 | R20.1 38.75,38.25 38.5,38.5 | R34.1 34.25,38.25 34,38.5 | R22.1 29.75,38.25 29.5,38.5 | R36.1 25.25,38.25 25,38.5 | R24.1 20.75,38.25 20.5,38.5 | J17.1 40.95,57.15 v36.25,57.15 35.15,58.25 35.15,60.5 33.5,62.15 31.55,62.15 30.8,61.4 30.8,58.6 v26.35,54.15 | J16.4 21.52,57.05 20.65,57.05 19.1,58.6 v18,58.6 17.15,58.6 15.1,56.55 | v11.6,56.55 15.1,56.55 | v14.95,52.25 14.95,56.4 15.1,56.55 | C37.1 48.55,28.7 v48.85,28.7
  Bottom 0.5: 48.55,22.1 R68.1 55.2,15.5 | 48.55,22.1 C33.1 | 55.2,15.5 55.2,13.5 R69.1 | 55.2,15.5 52.6,15.5 51.45,14.35 51.45,8.65 v49.3,6.5 | C36.1 44,17.5 44.5,17 47.5,17 48.45,17.95 48.45,18.05 | v48.4,20.65 48.4,20.4 48,20 v48,21.95 48.4,21.95 48.55,22.1 | v23.25,11.7 22,12.95 19.9,12.95 19.9,12.6 | v13.4,3.9 13.4,3.95 14.15,4.7 17.4,4.7 18.8,6.1 18.8,7.95 19.9,9.05 19.9,12.6 | 19.9,12.6 v18.45,14.05
  pour Bottom (no thermals): 47.7,29.9 49.2,29.9 49.2,11.05 48.75,10.6 47.35,10.6 47.35,17.3 47.7,17.65
+5V  (via drill 0.35)
  Top 0.2: IC6.3 48,39.58 | 48,39.58 47.67,39.58 C47.1 | 48,39.58 47.73,39.3 v46.5,39.3 | v40.4,39.35 40.4,39.3 39.1,38 39.1,30.6 37.45,28.95 32.95,28.95 v32.05,28.05 | LED2.A 56.15,26.4 38.1,26.4 37.6,25.9 v34.2,25.9 | v22.8,16.25 25.9,16.25 29.95,20.3 v32.5,20.3 | v19.05,19.45 20.8,21.2 v32.5,21.2
  Top 0.5: 13.05,41.3 SJ5.1 | U1.48 6.42,48.25 13.95,48.25 15.05,49.35 SJ2.1
  Top 1: U1.48 6.41,45 11.15,45 13.05,43.1 13.05,41.3
  Route15 1: U1.48 4.79,44.46 6.75,42.5 6.75,37.9 3.05,34.2 3.05,30.5 3.9,29.65 23.35,29.65 24.75,28.25 27.65,28.25 32.4,23.5 v32.4,22.6 | v32.4,22.6 v32.4,21.9 | v32.4,23.3 v32.4,22.6
  Bottom 0.2: v46.5,39.3 40.45,39.3 v40.4,39.35 | v32.05,28.05 32.4,27.7 32.4,25.9 C23.1 32.95,25.4 33.45,25.9 v34.2,25.9 | C19.1 v19.05,19.45 | C20.1 22.55,16 v22.8,16.25
  Bottom 0.25: IC2.9 v22.8,16.25 | R7.2 19.05,17.45 C19.1
  Bottom 0.5: C24.1 28.45,17.65 29.05,17.05 32.2,17.05 33.25,18.1 33.25,18.65 C21.1 | C22.1 32.8,22.2 v32.4,22.6
  pour Bottom (no thermals): 32.15,26.7 33.65,26.7 33.65,11.1 33.2,10.65 31.8,10.65 31.8,17.3 32.15,17.65
+24V  (via drill 0.3 pad 0.6, 0.35, 0.5, 0.5 pad 0.8)
  Top 0.2: LED1.A 40,27.25 v39.7,27.55 | 12.93,39.08 SJ5.3 | 4.5,18.15 5.5,19.15 9.2,19.15 10.2,18.15
  Top 0.25: v14.8,19 13.4,19 12.55,18.15 10.2,18.15 | v4.25,18.15 4.5,18.15 | v14.7,17.9 13.3,17.9 12.95,17.55 8.4,17.55 v7.78,18.17
  Top 0.75: v12.3,38.8 12.57,39.08 12.93,39.08
  Route15 0.4: 26.5,51.05 26.5,51 26.5,50.15 v26.4,50.05 | v36.9,48.75 36.9,51 | 48,51 48.25,50.75 v48.25,49.55 | 34.25,52 34,52
  Route15 0.75: v51.75,61.2 v41.75,61.2 v31.75,61.2 v21.8,61.2 v11.7,61.2 11.3,61.2 9.65,59.55 9.65,57.35 10,57 10,54 9,53 9,51.05 | v61,51 48,51 36.9,51 35.25,51 34.25,52 | 34,52 27.5,52 26.5,51 | 26.5,51.05 v16.15,51.05 9,51.05 | 9,51.05 5.5,51.05 v4.25,49.8 2.4,47.95 2.4,43.1 v5,40.5 5,38.9 1.5,35.4 1.5,29.75 3.75,27.5 16.25,27.5 v16.6,27.85 17.2,28.45 v17.3,28.45
  Bottom 0.2: C8.1 7.6,17.99 v7.78,18.17
  Bottom 0.25: R3.2 4.25,20.55 C7.1 v4.25,18.15 | IC1.9 8.05,18.44 v7.78,18.17
  Bottom 0.4: J1.1 v51.75,61.2 | J2.1 v41.75,61.2 | J5.1 11.75,61.15 v11.7,61.2 | J4.1 21.75,61.15 v21.8,61.2 | J3.1 v31.75,61.2 | J6.1 59.25,50.15 60.1,51 v61,51 | v4.25,49.8 J11.1 | J10.1 15.25,50.15 v16.15,51.05 | J9.1 26.25,49.9 v26.4,50.05 | J8.1 v36.9,48.75 | J7.1 v48.25,49.55
  Bottom 0.5: 16.65,15.35 L1.2 | 12.5,42.3 SJ1.3
  Bottom 0.75: v5,40.5 5.5,41 9.7,41 | 9.7,41 11,42.3 12.5,42.3 | v12.3,38.8 10.1,41 9.7,41
  pour Bottom (no thermals): 40.45,20.65 40.45,21.45 41.5,22.5 41.5,28.7 40.25,29.95 25.95,29.95 25.95,28.4 37.1,28.4 37.9,27.6 37.9,25.25 38.55,25.25 38.55,22.35 39.25,21.65 39.25,20.65
  pour Bottom (no thermals): 24.9,20.7 24.9,21.5 25.95,22.55 25.95,29.95 16.1,29.95 16.1,21.55 15.05,20.5 14.55,20.5 14.35,20.3 14.35,17.8 15.2,16.95 15.2,13 15.55,12.65 17.5,12.65 17.7,12.85 17.7,28.25 22.05,28.25 22.35,27.95 22.35,25.3 23,25.3 23,22.4 23.7,21.7 23.7,20.7
BLADE_SWTICH  (via drill 0.35)
  Top 0.2: J18.2 34.25,57.15 R75.2 35.2,56.9 v35.4,56.7 | U1.29 53.05,48.4 51.4,50.05 50.1,50.05 48.15,52 41.95,52 v40.6,53.35
  Bottom 0.2: v35.4,56.7 35.4,56.6 38.7,53.3 40.55,53.3 v40.6,53.35
BLT_EN  (via drill 0.35)
  Top 0.4: J19.5 30.1,48.85 v29.9,48.85
  Route15 0.2: v29.9,48.85 31.45,47.3 31.45,44 32.3,43.15 32.3,38.85 31.45,38 31.45,33.9 30.19,32.64 U1.11
BLT_RX  (via drill 0.35)
  Top 0.2: v34.4,45.4 34.4,45.25 29.1,39.95 29.1,37.75 29.85,37 29.85,33.58 U1.10 | v34.75,48.05 35.55,48.85 J19.1
  Bottom 0.2: v34.4,45.4 34.35,45.4 34,45.75 34,47.5 34.55,48.05 v34.75,48.05
BLT_TX
  Top 0.2: J19.2 34,49 34,45.95 28.55,40.5 28.55,37.2 29.35,36.4 29.35,34.22 27.76,32.63 26.36,32.63 U1.9
BMI_CS
  Top 0.2: U1.12 32.73,32.58 34.6,34.45 34.6,38.7 34.3,39 IC4.12
BMI_INT1  (via drill 0.35)
  Top 0.2: IC4.4 32.25,40.7 v31.6,41.35 | v25.85,33.65 25.6,33.65 23.8,31.85 23.8,30.4 23.45,30.05 21.35,30.05 U1.7
  Route15 0.2: v31.6,41.35 31.35,41.35 30.45,40.45 30.45,36.85 28.35,34.75 26.95,34.75 v25.85,33.65
CAN_H
  Top 0.3: IC6.7 53.17,40.23 R59.2 57.25,40.75 57.5,41 X2.3
CAN_L
  Top 0.3: IC6.6 53.27,39.58 R59.1 56.85,39.15 X2.2
CAN_RX  (via drill 0.35)
  Top 0.2: IC6.4 48.83,36.42 50.5,34.75 56.7,34.75 v58.15,33.3
  Bottom 0.2: v58.15,33.3 58.15,31.4 U1.22
CAN_TX
  Top 0.2: U1.23 59.42,32.63 56.52,32.63 54.95,34.2 50.2,34.2 45.65,38.75 45.65,40.35 46.6,41.3 47.95,41.3 48.38,40.88 IC6.1
DIPSW_ADC
  Top 0.2: 14.9,27.75 15.7,27.75 16.5,26.95 18.25,26.95 19.6,28.3 25.9,28.3 26.9,27.3 32.4,27.3 33.5,28.4 37.85,28.4 39.45,30 43,30 44.05,30 U1.17 | R64.2 14.95,27.8 14.9,27.75 | 14.9,27.75 14.7,27.55 14.7,23.45 14.25,23 R65.1 | S1.1 9.81,28.81 10.9,29.9 13.95,29.9 14.2,29.65 14.2,28.1 14.55,27.75 14.9,27.75
ENC_A  (via drill 0.35)
  Top 0.2: U1.4 14.18,33.15 17.9,33.15 18.75,32.3 18.75,29.95 18.3,29.5 v18.3,27.9 | v53.95,14.35 53.95,19.8 48.8,24.95 19,24.95 v18.9,25.05
  Bottom 0.2: C50.1 53.9,13.5 R71.1 v53.95,14.35 | v18.9,25.05 18.9,27.3 v18.3,27.9
ENC_B
  Bottom 0.2: C51.1 60.25,13.5 R72.1 60.2,20.2 63.21,23.21 U1.24
GND  (via drill 0.3, 0.3 pad 0.6, 0.35)
  Top 0.2: C46.2 50.45,37.95 v50.45,39.5 IC6.EP 50.12,40.23 | C47.2 47.58,40.23 IC6.2 50.12,40.23 | IC6.8 50.77,40.88 50.12,40.23 | R13.1 v54.15,27.5 | R14.1 v58.15,27.5 | R15.1 62.2,27.5 v62.15,27.45 | IC4.7 31.05,38.5 30.7,38.15 | 30.7,38.15 C53.2 | IC4.6 31.4,39 v31.15,39.25 30.95,39.05 C52.2 30.7,38.95 30.7,38.15 | 16,39.5 v16,39.6 | R81.1 12.05,28.55 v11.45,28.55 | R41.2 v14.4,13.4 14.45,13.45 C38.2 | v16.25,8.45 15.1,9.6 R40.2 14.2,9.4 13.1,9.4 12.82,9.68 U2.5 | R39.1 1.07,11 v1.05,11.03
  Top 0.3: X2.1 57.45,36.55 v57.45,35.6
  Top 0.4: J15.5 11.45,58.85 v10.7,58.85 | J18.5 v29.55,58.6 | J14.5 49,58.9 v48.35,58.9 | J19.4 31.8,50.25 32.15,50.6 v33.05,50.6 | J16.3 21.68,55.73 C48.2 | J17.2 46.14,55.76 C49.2 | R77.1 v33,55.2 | R76.1 v31.5,55.2 | C39.2 7.9,57.3 v7.55,56.95 | U3.5 11,52.7 v11,52.5 | v7,52.8 7,52.73 | Q1.3 16,38.98 | 16,38.98 Q1.2 Q1.1 | R73.1 v16,39.6 | 16,38.98 16,39.5 | J12.5 v55.25,5.3 | J13.5 16.7,6.15 17.05,6.5 v17.05,6.85
  Top 0.5: X1.1 v11.75,41 | S1.4 1.4,27.32 v1.4,27.3 | R51.2 R50.2 v13.15,54.2 | R38.1 5.42,11.25 1.52,11.25 R39.1 | R49.1 1.05,52.42 v1.05,53.7 | R48.1 6.15,52.1 6.85,52.8 v7,52.8 | SW3.B2 11.5,19.57 v11.5,20.65
  Bottom 0.2: C51.2 v62.3,12.4 | C50.2 v52.75,11.6
  Bottom 0.25: C28.2 v39.3,14 | C32.2 v38.1,14 | R10.1 v36.9,14 | C29.2 v35.7,14 | R12.1 36.1,20.75 IC3.14 | R90.1 v35.45,22.2 | C16.2 v23.75,14 | C20.2 v22.55,14 | R6.1 v21.35,14 | C17.2 20.35,14.6 v20.35,14 | R8.1 20.55,20.8 IC2.14 | R87.1 v19.9,22.3
  Bottom 0.3: OLED1.1 22.85,2.95 23.05,2.75 27.8,2.75 | 27.8,2.75 29.25,2.75 | 29.25,2.75 30.35,2.75 30.55,2.95 OLED1.12 30.55,8.15 C42.2 v31.45,10.05 | OLED1.10 29.15,2.85 29.25,2.75 | 27.8,2.75 27.75,2.8 OLED1.8 27.75,8.05 C43.2 v28.75,10 | C55.2 v25.45,12.5 | OLED1.30 43.15,8 | 43.15,8 43.15,8.35 C41.2 v44.05,8.4 | OLED1.29 42.45,7.3 43.15,8 | R58.1 v39.75,10.25 | C40.2 v40.95,10.25 | R4.1 5.7,22.95 IC1.14
  Bottom 0.4: J5.3 v14.25,60 | J4.3 v24.25,60 | J3.3 v34.25,60 | J2.3 v44.25,60 | J1.3 v54.25,60 | J11.3 6.6,48.6 | J10.3 18.5,48 v18.55,48 | J9.3 28.75,49 v29.4,49.65 | J8.3 40.2,48.3 v40.6,48.3 | J7.3 v51.7,48.75 | J6.3 v62.7,48.75 | OK6.3 64.14,37.97 v64.1,38 | OK1.3 59.63,35.62 v59.65,35.6 | OK7.3 55.13,35.56 v55.15,35.55 | OK2.3 50.63,35.56 v50.65,35.55 | OK8.3 46.13,35.59 v46.1,35.55 | OK3.3 41.63,35.56 v41.65,35.55 | OK9.3 37.13,35.56 v37.15,35.55 | OK4.3 32.63,35.56 v32.65,35.55 | OK10.3 28.14,35.56 v28.15,35.55 | OK5.3 23.64,36.09 v23.4,35.85 | OK11.3 19.14,36.06 v19.65,35.55 | SJ1.1 12.05,40.7 v11.75,41
  Bottom 0.5: C4.2 v8.8,15.9 9.3,15.4 R78.1 | C8.2 v7.6,15.9 | R2.1 v6.4,15.9 | C5.2 v5.2,15.9 | C3.2 2,27.3 v1.4,27.3 | J11.3 7.33,48.17 U1.47
  other vias: 22.8,19.2 35.4,26.7 36.2,26.7 37,26.7 19.85,25.6 20.65,25.6 21.45,25.6 20.25,26.35 21.05,26.35 22.7,10.55 22.7,9.75 21.1,9.75 21.1,10.55 17.05,8.45 17.05,7.65 16.25,7.65 16.25,6.85 22.35,19.8 22.35,18.6 26.25,18.6 26.25,19.8 23.35,19.8 25.35,19.8 23.35,18.6 25.35,18.6 24.35,18.6 24.35,19.8 23.8,19.2 24.8,19.2 25.8,19.2 38.35,19.15 37.9,19.75 37.9,18.55 41.8,18.55 41.8,19.75 38.9,19.75 40.9,19.75 38.9,18.55 40.9,18.55 39.9,18.55 39.9,19.75 39.35,19.15 40.35,19.15 41.35,19.15 11.5,21.85 10.9,20.65 10.9,21.85 10.9,21.25 11.5,21.25 8.55,20.6 8.55,21.25 8.55,21.85 6.6,33.55 2.7,40.35 21.4,3.9 46.05,5.4 45.55,9.1 40.7,11.95 57.35,7.55 64.25,9.35 64.3,14.4 57.75,16.95 59.25,22 64.15,21.4 52.6,23.7 61.75,32.9 43.85,33.35 59.35,45.2 54.3,45.55 39.75,55.45 37.55,58.6 57,57.05 54.2,62.25 44.75,62.55 41.7,62.65 34.65,62.9 31.05,63 25,62.9 21.4,62.9 14.8,62.85 11.3,62.9 0.95,56.4 1.2,48.05 9.3,35.35 27.75,2.75 29.15,2.75 30.55,2.75 47.35,33.35 50.85,33.35 53.35,33.35
  pour Route2 (isolate 0.254, no thermals): 0,0 66,0 66,64 0,64
  pour Bottom (no thermals): 42.45,18.3 43.25,18.3 43.5,18.55 43.6,18.65 44.35,18.65 44.9,18.1 44.9,17.7 46.4,17.7 46.4,29.9 44.05,29.9 43.1,28.95 42.8,28.65 42.8,27.4 42.8,22.5 42.1,21.8 41.6,21.3 40.75,21.3 40.75,20 38.95,20 38.95,21.3 38.75,21.3 38.75,20 37.95,20 37.95,21.3 37.75,21.3 37.75,20 36.7,20 36.7,18.8 37.65,18.8 37.65,18.3 39.25,18.3 39.25,17 39.45,17 39.45,18.3
  pour Bottom (no thermals): 23.9,18.35 27.7,18.35 28.05,18.7 28.8,18.7 29.35,18.15 29.35,17.75 30.85,17.75 30.85,27.95 27.25,27.95 27.25,22.55 26.05,21.35 25.2,21.35 25.2,20.05 23.4,20.05 23.4,21.35 23.2,21.35 23.2,20.05 22.4,20.05 22.4,21.35 22.2,21.35 22.2,20.05 21.15,20.05 21.15,18.85 22.1,18.85 22.1,18.35 23.7,18.35 23.7,17.05 23.9,17.05
  pour Bottom (no thermals): 35.1,27.85 37,27.85 37.3,27.55 37.3,25.4 37.15,25.25 35.1,25.25
  pour Bottom (no thermals): 19.55,27.9 21.45,27.9 21.75,27.6 21.75,25.45 21.6,25.3 19.55,25.3
  pour Bottom (no thermals): 23.05,10.9 20.75,10.9 20.75,9.4 23.05,9.4
  pour Bottom (no thermals): 17.35,8.75 15.05,8.75 15.05,5.65 17.35,5.65
  pour Bottom (no thermals): 14.85,29.95 11,29.95 11,24.1 10.45,23.55 10.45,22.1 8.65,22.1 8.65,23.45 8.45,23.45 8.45,22.1 7.65,22.1 7.65,23.45 7.45,23.45 7.45,22.55 7,22.1 6.35,22.1 6.35,20.9 7.35,20.9 7.35,20.4 8.95,20.4 8.95,19.05 9.15,19.05 9.15,20.4 12.1,20.4 12.8,19.7 13.8,19.7 13.8,20.35 14.35,20.9 14.85,20.9
  pour Route15 (isolate 0.254, no thermals): 0,0 66,0 66,64 0,64
I2C_SCL_OLED  (via drill 0.35)
  Route15 0.2: U1.41 24.1,45.09 24.1,32.4 23.8,32.1 23.8,30.6 25.25,29.15 28.35,29.15 33.35,24.15 33.35,13.65 34.65,12.35 v34.65,11.45
  Bottom 0.2: OLED1.18 34.75,7.6 34.5,7.85 34.5,11.3 v34.65,11.45 35.45,11.45 R85.2
I2C_SDA_OLED  (via drill 0.35)
  Route15 0.2: U1.40 24.61,46.12 24.61,33.64 26.3,31.95 26.3,30.7 27,30 28.5,30 33.9,24.6 33.9,14 35.35,12.55 35.35,9.5 v35.4,9.45
  Bottom 0.2: OLED1.19 35.45,8.4 SJ4.1 v35.4,9.45 35.4,10.2 R84.2
LDR_LEFT  (via drill 0.35)
  Top 0.2: J18.3 R77.2 33.5,56.9 33.75,56.65 33.75,55.2 v33.9,55.05
  Bottom 0.2: U1.32 42.45,49.6 41.2,49.6 35.75,55.05 v33.9,55.05
LDR_RIGHT  (via drill 0.35)
  Top 0.2: J18.4 31.75,57.15 R76.2 31.95,56.9 32.25,56.6 32.25,54.7 32.7,54.25 v34.35,54.25
  Bottom 0.2: U1.33 42.89,48.11 41.95,49.05 41.1,49.05 35.9,54.25 v34.35,54.25
LED_BLUE
  Top 0.2: R63.1 54.75,53.4 53.8,52.45 53.8,50.05 56,47.85 56.9,47.85 U1.27
LED_GREEN
  Top 0.2: R62.1 54.5,52.2 54.3,52 54.3,50.5 56.35,48.45 58.84,48.45 U1.26
LED_RED
  Top 0.2: R61.1 55.1,50.49 56.59,49 60.83,49 U1.25
LINE1_IN
  Top 0.2: U1.18 46.09,29.5 39.6,29.5 38,27.9 34,27.9 32.6,26.5 26.55,26.5 25.35,27.7 19.7,27.7 17.6,25.6 17.6,16.2 19.2,14.6 19.2,13.75 18.8,13.35 16.9,13.35 15.35,11.8 R41.1 14.18,11.58 U2.7 12.08,11.58 11.45,10.95 11.45,9.4 10.9,8.85 SJ9.2
LINE2_IN  (via drill 0.35)
  Top 0.2: U1.19 50.06,31.38 47.68,29 39.85,29 38.25,27.4 34.5,27.4 33.1,26 26.2,26 25.15,27.05 19.85,27.05 18.15,25.35 18.15,16.45 19.7,14.9 19.7,13.4 18.9,12.6 v18.35,12.6 17.05,12.6 15.05,10.6 R40.1 14.08,10.92 U2.6 | SJ10.2 8.4,13.75 v10.7,13.75
  Bottom 0.2: v10.7,13.75 10.7,13.45 11.9,12.25 18,12.25 v18.35,12.6
LINE3_IN  (via drill 0.35)
  Top 0.2: U3.7 v11.32,54.98 11.35,54.98 11.35,54.85 11.4,54.8 R51.1 | SJ7.2 3.4,54.9 v3.5,55 | U1.31 45.09,49.5 36.9,49.5 34.55,51.85 31.45,51.85 25.85,57.45 22.05,57.45 v20.7,56.1
  Route15 0.2: v11.32,54.98 11.97,54.98 14.14,57.15 19.3,57.15 19.65,57.5 20.25,57.5 20.7,57.05 v20.7,56.1
  Bottom 0.2: v3.5,55 4.15,55.65 5.3,55.65 5.9,56.25 7.3,56.25 8.57,54.98 v11.32,54.98
LINE4_IN  (via drill 0.35)
  Top 0.2: U3.6 10.93,54.32 11.32,53.92 v11.32,53.62 11.35,53.6 R50.1 | SJ8.2 5.32,53.78 v5.44,53.78 | U1.30 50.06,46.62 46.63,50.05 37.1,50.05 34.8,52.35 31.75,52.35 26.15,57.95 21.15,57.95 v19.95,56.75
  Route15 0.2: v19.95,56.75 14.45,56.75 v11.32,53.62
  Bottom 0.2: v5.44,53.78 5.49,53.72 11.23,53.72 v11.32,53.62
N$1
  Bottom 0.25: C4.1 8.55,18.05 IC1.8
N$2
  Bottom 0.25: R91.2 36.85,22.85 R9.2 37.85,22.2 38.35,21.7 IC3.18
N$3
  Bottom 0.2: R1.2 6.7,24.6 5.8,23.7 4.55,23.7 3.35,22.5 TP2.TP
  Bottom 0.25: IC1.18 8.05,23.68 7.12,24.6 R1.2
N$4
  Bottom 0.25: IC1.10 7.55,18.93 6.4,17.77 R2.2
N$5
  Bottom 0.25: IC1.12 5.4,20.5 R3.1 | R4.2 R3.1 | R3.1 5.3,19.45 C7.2
N$6
  Bottom 0.25: IC1.11 6.67,19.43 5.2,17.95 C5.1
N$7
  Bottom 0.25: IC2.8 23.3,16.8 23.75,16.35 C16.1
N$8
  pour Bottom (no thermals): 12.15,19.75 9.95,19.75 9.95,18.85 10.45,18.35 11.7,17.1 11.7,13.55 11.7,13 12.05,12.65 13.6,12.65 13.6,18.3
N$9
  Bottom 0.25: C6.2 9.95,17.93 9.55,18.32 IC1.6
N$10
  Bottom 0.25: IC2.11 21.8,17.25 21.2,16.65 20.85,16.65 20.15,15.95 C17.1
N$11
  Bottom 0.25: IC2.10 22.3,16.9 21.35,15.95 R6.2
N$12
  pour Bottom (no thermals): 24.7,17.7 27.2,17.7 28.65,16.25 29.15,16.25 29.15,10.65 27.75,10.65 26.65,11.75 26.65,15.2 25.15,16.7 24.8,16.7 24.7,16.8
N$13
  Bottom 0.25: IC2.6 24.3,16.6 24.9,16 C18.2
N$14
  Bottom 0.25: IC2.12 20.3,18.45 C19.2 | C19.2 20.15,17.45 R7.1 | C19.2 20.1,18.65 R8.2
N$16
  Bottom 0.25: IC3.8 38.85,16.75 39.3,16.3 C28.1
N$17
  Bottom 0.25: IC3.11 37.35,17.2 36.8,16.65 36.45,16.65 C29.1
N$18
  Bottom 0.25: IC3.10 37.85,16.8 R10.2
N$19
  pour Bottom (no thermals): 40.25,17.7 42.75,17.7 44.2,16.25 44.7,16.25 44.7,10.65 43.25,10.65 42.2,11.7 42.2,15.2 40.7,16.7 40.35,16.7 40.25,16.8
N$20
  Bottom 0.25: IC3.6 39.85,16.65 40.45,16.05 C30.2
N$21
  Bottom 0.25: IC3.12 35.85,18.4 C31.2 | C31.2 35.65,18.6 R12.2 | C31.2 35.7,17.4 R11.1
N$22
  Top 0.2: R13.2 53.25,28.5 LED1.C
N$23
  Top 0.2: R14.2 57.25,28.5 LED2.C
N$24
  Top 0.2: R15.2 61.25,28.5 LED3.C
N$25
  Bottom 0.2: R17.2 56.9,43.45 56.9,47.45 55,49.35 55,54.5 53,56.5 J1.2
N$26
  Bottom 0.2: R19.2 47.75,44.45 46.65,45.55 46.65,48.9 50.55,52.8 50.55,55.15 49.35,56.35 43.8,56.35 43,57.15 J2.2
N$27
  Bottom 0.2: OK1.1 58.37,42.37 57.7,41.7 R17.1
N$28
  Bottom 0.2: OK2.1 49.37,42.37 48.7,41.7 R19.1
N$29
  Bottom 0.2: R21.2 38.75,44.95 38.25,45.45 37.1,45.45 36.5,46.05 36.5,47.55 36.15,47.9 36.15,49.55 36.55,49.95 36.55,52.8 35.85,53.5 33.6,53.5 32.25,54.85 32.25,55.75 33,56.5 J3.2
N$30
  Bottom 0.2: OK3.1 40.37,42.37 39.7,41.7 R21.1
N$31
  Bottom 0.2: R23.2 29.75,43.35 27.85,45.25 24.7,45.25 23.9,46.05 23.9,48.25 25.65,50 25.65,54.9 23,57.55 J4.2
N$32
  Bottom 0.2: OK4.1 31.36,42.37 30.7,41.7 R23.1
N$33
  Bottom 0.2: R25.2 20.75,43.4 19.45,44.7 14.8,44.7 13.7,45.8 13.7,49.05 14.25,49.6 14.25,55 13.45,55.8 11.15,55.8 10.65,56.3 10.65,56.8 11.05,57.2 12.65,57.2 13,57.55 J5.2
N$34
  Bottom 0.2: OK5.1 22.36,42.37 21.7,41.7 R25.1
N$35
  Bottom 0.2: J11.2 5.5,48 6.05,47.45 6.05,46.25 9,43.3 R27.2
N$36
  Bottom 0.2: OK11.1 17.86,42.37 17.2,41.7 R27.1
N$37
  Bottom 0.2: R29.2 61.25,44.75 62,45.5 62,47.3 61.55,47.75 61.05,47.75 60.5,48.3 J6.2
N$38
  Bottom 0.2: OK6.1 62.87,42.37 62.2,41.7 R29.1
N$39
  Bottom 0.2: R31.2 52.25,43.35 50.45,45.15 50.05,45.15 49.3,45.9 49.3,47.5 49.5,47.7 J7.2
N$40
  Bottom 0.2: OK7.1 53.87,42.37 53.2,41.7 R31.1
N$41
  Bottom 0.2: R33.2 43.25,44.5 42.35,45.4 39.6,45.4 39.05,45.95 39.05,47.35 38.5,47.9 J8.2
N$42
  Bottom 0.2: OK8.1 44.87,42.37 44.2,41.7 R33.1
N$43
  Bottom 0.2: J9.2 27.5,48.45 28.9,47.05 28.9,45.95 30.55,44.3 33.4,44.3 34.25,43.45 R35.2
N$44
  Bottom 0.2: OK9.1 35.87,42.37 35.2,41.7 R35.1
N$45
  Bottom 0.2: R37.2 25.25,43.4 23.25,45.4 16.65,45.4 16.2,45.85 16.2,47.3 16.5,47.6 J10.2
N$46
  Bottom 0.2: OK10.1 26.86,42.37 26.2,41.7 R37.1
N$47
  Top 0.2: R38.2 8.2,11.25 9.16,12.21 U2.1
N$48  (via drill 0.35)
  Top 0.2: U2.3 9.42,10.92 9.25,10.75 9.25,9.6 9.35,9.5 v9.45,9.5 | R39.2 4.35,10 v4.4,10.05
  Route15 0.2: v4.4,10.05 4.95,9.5 v9.45,9.5
N$49  (via drill 0.35)
  Top 0.2: R44.2 46.85,8.5 43.3,4.95 v18.95,4.95 | U2.2 11.08,11.58 11.25,11.75 11.25,12.7 10.95,13 9.2,13 8.9,12.7 SJ10.1 7.9,12.7 7,11.8 7,9.1 9,7.1 v9.4,7.1
  Top 0.3: R44.2 R43.2 R42.2
  Route15 0.2: v9.4,7.1 11.55,4.95 v18.95,4.95
N$50
  Top 0.2: R47.2 R46.2 R45.2 11.9,8.3 11.15,7.55 10.3,7.55 10.1,7.75 SJ9.1 10.1,10.11 U2.4
N$51
  Top 0.2: J13.4 15.45,6.25 R47.1
N$52
  Top 0.2: J13.3 14.2,6.35 R46.1
N$53
  Top 0.3: J12.4 53.05,5.95 53.9,6.8 R42.1
N$54
  Top 0.3: J12.3 51.8,6 52.7,6.9 R43.1
N$55
  Top 0.3: J12.2 50.55,6.05 51.5,7 R44.1
N$56
  Top 0.2: J13.2 12.95,6.4 R45.1
N$57  (via drill 0.35)
  Top 0.2: U3.1 6.33,55.62 v6.3,55.65 | R48.2 v7.5,52
  Bottom 0.2: v6.3,55.65 5.7,55.05 4.9,55.05 3.7,53.85 3.7,51.75 4.05,51.4 4.85,51.4 5.45,52 v7.5,52
N$58  (via drill 0.35)
  Top 0.2: U3.3 6.37,54.32 v6.35,54.3 | v4.4,52.15 3.9,51.65 R49.2
  Bottom 0.2: v6.35,54.3 6.05,54.6 5.3,54.6 4.4,53.7 v4.4,52.15
N$59  (via drill 0.35)
  Top 0.2: R54.2 R53.2 R52.2 50.1,56 47.95,58.15 39.4,58.15 34.6,53.35 32.4,53.35 26.75,59 v20.15,59 | SJ8.1 4.98,54.98 U3.2 8.48,54.98 8.8,55.3 v8.8,56.3
  Bottom 0.2: v20.15,59 19.7,59.45 15.35,59.45 15.1,59.7 15.1,60.55 13.65,62 11.3,62 10.7,61.4 10.7,59.8 8.8,57.9 v8.8,56.3
N$60
  Top 0.2: R57.2 R56.2 R55.2 14.25,56 14.2,55.95 14.2,53.2 12.85,51.85 10.05,51.85 8.21,53.69 U3.4 6.63,53.69 6,53.05 3.8,53.05 2.75,54.1 SJ7.1
N$61
  Top 0.2: J14.4 50.55,57.05 R52.1
N$62
  Top 0.2: J14.3 R53.1
N$63
  Top 0.2: J14.2 53.05,57.05 R54.1
N$64
  Top 0.2: J15.4 12.95,57.05 R57.1
N$65
  Top 0.2: J15.3 R56.1
N$66
  Top 0.2: J15.2 15.45,57.05 R55.1
N$67
  Bottom 0.3: OLED1.2 23.55,7.5 23.25,7.8 22.52,7.8 21.02,6.3 C45.2
N$68
  Bottom 0.3: OLED1.3 24.25,7.7 23.58,8.37 22.22,8.37 21.65,7.8 C45.1
N$69
  Bottom 0.3: OLED1.4 24.95,7.95 24.55,8.35 C44.2
N$70
  Bottom 0.3: OLED1.5 25.65,8.75 25.95,9.05 C44.1
N$71
  Bottom 0.3: OLED1.26 40.35,7.65 39.75,8.25 R58.2
N$72
  Bottom 0.3: OLED1.27 41.05,8.25 C40.1
N$73
  Bottom 0.3: OLED1.28 41.75,7.5 42.1,7.85 C41.1
N$74
  Top 0.2: D1.3 56.7,50.4 R61.2
N$75
  Top 0.2: D1.2 R62.2
N$76
  Top 0.2: D1.1 56.7,54 R63.2
N$77
  Bottom 0.2: SW1.A 55.25,12.35 R69.2 R71.2
N$78
  Bottom 0.2: SW1.B 60.25,12.4 R72.2 R70.2
N$79
  Top 0.4: SJ2.2 24.65,50.15 26.8,48 30.45,48 30.7,48 32.55,48 33.05,48.5 J19.3
N$80
  Top 0.4: SJ5.2 12.25,40 11.25,39 X1.2
N$81
  Top 0.4: SJ3.2 X1.3
N$82  (via drill 0.35)
  Route15 0.2: v2.45,9.8 2.45,11.45 v5.5,14.5
  Bottom 0.3: R78.2 5.9,14.9 v5.5,14.5 4.95,14.5 3.75,15.7 D3.2 | Q2.1 2.36,9.8 v2.45,9.8
N$83
  pour Bottom (no thermals): 10.3,7.7 6.4,7.7 5.55,8.55 5.55,10.95 5.2,11.3 1.25,11.3 1.25,13.1 6.05,13.1 6.85,13.9 9.6,13.9 11.6,11.9 18.2,11.9 19.1,11 19.1,9.35 16.65,9.35 16.5,9.5 16.5,10.2 16.2,10.5 11.65,10.5 10.55,9.4 10.55,7.95
N$84
  Top 0.4: SJ3.3 14.99,36.2 Q1.5 15.07,36.58 15.5,37 16,37 | 16,37 16.25,37.25 | 16.25,37.25 16.5,37.5 17.02,36.98 Q1.8 | Q1.6 15.72,36.73 16,37 | Q1.7 16.38,37.12 16.25,37.25
N$85
  pour Bottom (no thermals): 13.95,10.05 13.95,5.6 12.75,4.4 8.35,4.4 8.35,5.8 9.05,6.5 10,6.5 11.05,7.55 11.05,9.1 12,10.05
N$86
  Top 0.2: S1.7 7.27,22.43 7.52,22.68 9.81,22.68 S1.8 9.81,22.26 10.55,23 R65.2 R66.2
N$87
  Top 0.2: R79.2 R81.2
N$88
  Top 0.2: R80.1 R66.1
N$89
  Bottom 0.2: OLED1.20 36.15,8.4 SJ4.2
N$90
  Bottom 0.25: IC2.18 22.8,21.85 22.3,22.35 R5.2 22.1,23.15 R88.2
N$91
  Top 0.2: S1.3 S1.2 7.27,27.43 9.4,25.3 12.5,25.3 R67.1 R80.2
N$92  (via drill 0.35)
  Top 0.2: v3.25,20.8 3.25,20.68 | 3.25,20.68 2.24,20.68 2.19,20.73 S1.5 | S1.6 4.73,20.68 3.25,20.68 | R67.2 R79.1 11.55,27.8 11.05,27.3 11.05,26.6 v10.65,26.2
  Route15 0.2: v3.25,20.8 3.25,21.25 8.2,26.2 v10.65,26.2
OLED_RES  (via drill 0.35)
  Top 0.3: v31.95,7.8 30.75,9 28.25,9 v26.65,10.6
  Bottom 0.3: OLED1.14 v31.95,7.8 | v26.65,10.6 C55.1 25.4,10.65 R83.2
OLED_SA0
  Bottom 0.2: OLED1.15 32.65,8.65 34,10 34,12.15 34.55,12.7 R82.2
PGOOD_24V  (via drill 0.35)
  Top 0.2: v34.55,24 18.95,24 v18.9,24.05
  Route15 0.2: v6.6,23.6 18.45,23.6 v18.9,24.05
  Bottom 0.2: R90.2 35.4,24 v34.55,24 | R87.2 19,24.15 v18.9,24.05 | IC1.16 6.6,23.52 v6.6,23.6
  Bottom 0.25: R89.1 R91.1 R90.2 | R86.1 R88.1 R87.2
PUSHBUTTON_ENC
  Bottom 0.2: R68.2 55.25,23.15 SW1.D 56.15,25.9 56.15,30.82 U1.21
PUSHBUTTON_LEFT  (via drill 0.35)
  Top 0.2: SW3.A2 13.38,16.8 14.4,16.8 | 14.4,16.8 15.2,16.8 15.6,17.2 15.6,26.2 v15.55,26.25 | R60.2 14.4,16.8
  Bottom 0.2: U1.5 15.55,30.78 v15.55,26.25
SENSOR1_IN  (via drill 0.35)
  Top 0.2: v58.5,35 58.7,34.8 60,34.8 60.55,35.35 60.55,41.45 57.25,44.75 45.35,44.75 44.15,45.95 44.15,47.4 42.55,49 38.15,49 35.77,46.62 U1.36
  Bottom 0.2: R16.2 58.27,36.75 OK1.4 58.37,35.13 v58.5,35
SENSOR2_IN  (via drill 0.35)
  Top 0.2: v38,44.75 38.15,44.6 38.75,44.6 v47.7,35.65
  Bottom 0.2: OK2.4 49.27,36.75 R18.2 47.75,35.9 47.6,35.75 v47.7,35.65 | U1.37 32.73,45.97 34,44.7 37.95,44.7 v38,44.75
SENSOR3_IN  (via drill 0.35)
  Top 0.2: v28,33.85 28.85,34.7 28.85,35.95 27.85,36.95 27.85,43.2 30.19,45.54 U1.38
  Bottom 0.2: OK3.4 40.27,36.75 R20.2 38.75,35.8 36.65,33.7 28.15,33.7 v28,33.85
SENSOR4_IN  (via drill 0.35)
  Top 0.2: U1.39 27.65,44.95 27.15,44.45 v27.15,35.65
  Bottom 0.2: OK4.4 31.27,36.75 R22.2 29.75,35.45 29.25,34.95 27.65,34.95 27.15,35.45 v27.15,35.65
SENSOR5_IN
  Bottom 0.2: R24.2 22.27,36.75 OK5.4 22.36,35.48 25.2,32.65 41.62,32.65 U1.16
SENSOR6_IN
  Bottom 0.2: OK6.4 62.77,36.75 R28.2 61.25,35.45 59.9,34.1 58,34.1 55.77,34.1 U1.20
SENSOR7_IN  (via drill 0.35)
  Top 0.2: v45.15,35.4 45.15,36.95 v40.6,41.5 | U1.42 21.51,48.1 v25,48.1
  Route15 0.2: v25,48.1 26,48.1 28.25,50.35 31,50.35 32.7,48.65 35.5,48.65 36.5,47.65 36.5,45 40,41.5 v40.6,41.5
  Bottom 0.2: OK7.4 53.77,36.75 R30.2 52.25,35.8 51.3,34.85 45.7,34.85 v45.15,35.4
SENSOR8_IN  (via drill 0.35)
  Top 0.2: U1.43 17.49,46.02 26.5,37.01 26.5,35.25 26.8,34.95 26.8,33.75 v27.05,33.5
  Bottom 0.2: OK8.4 44.77,36.75 R32.2 43.25,35.85 40.6,33.2 27.35,33.2 v27.05,33.5
SENSOR9_IN  (via drill 0.35)
  Top 0.2: v26,34.7 26,36.55 19.15,43.4 17.4,43.4 14.95,45.85 U1.44
  Bottom 0.2: OK9.4 35.77,36.75 R34.2 34.25,36 32.75,34.5 26.2,34.5 v26,34.7
SENSOR10_IN  (via drill 0.35)
  Top 0.2: U1.45 16.53,42.5 18.85,42.5 25.3,36.05 v25.3,35.8
  Bottom 0.2: OK10.4 26.77,36.75 R36.2 25.25,35.85 v25.3,35.8
SENSOR11_IN
  Bottom 0.2: R26.2 17.77,36.75 OK11.4 17.86,35.77 17.49,35.39 U1.6
SENSOR_RAIL
  Bottom 0.4: OK6.2 64.14,41.63 63,40.5 59.5,40.5 | 59.5,40.5 55,40.5 | 55,40.5 50.5,40.5 | 50.5,40.5 46,40.5 | 46,40.5 41.5,40.5 | 41.5,40.5 37,40.5 | 37,40.5 32.5,40.5 | 32.5,40.5 28,40.5 | 28,40.5 23.5,40.5 | 23.5,40.5 19,40.5 | OK5.2 23.64,40.63 23.5,40.5 | OK10.2 28.14,40.63 28,40.5 | OK4.2 32.63,40.63 32.5,40.5 | OK9.2 37.13,40.63 37,40.5 | OK3.2 41.63,40.63 41.5,40.5 | OK8.2 46.13,40.63 46,40.5 | OK2.2 50.63,40.63 50.5,40.5 | OK7.2 55.13,40.63 55,40.5 | OK1.2 59.63,40.63 59.5,40.5 | 19,40.5 15.5,40.5 14.5,41.5 SJ1.2 | OK11.2 19.14,40.63 19,40.5
SENSOR_START
  Top 0.2: J16.2 19.22,54.27 19.22,57.07 20.6,58.45 26.5,58.45 32.1,52.85 34.95,52.85 36.5,54.4 40.6,54.4 42.5,52.5 48.5,52.5 | J17.3 48.68,52.53 48.65,52.5 48.5,52.5 | 48.5,52.5 50.4,50.6 51.5,50.6 51.61,50.6 U1.28
SENSOR_STOP
  Top 0.2: J16.1 16.6,52.6 12.95,48.95 5.9,48.95 5.05,48.1 3.85,48.1 3.15,47.4 3.15,46.15 4.35,44.95 5,44.95 6,43.95 6,36.45 9.87,32.58 U1.3
SERVO_OUT1
  Top 0.2: R73.2 15,41 15.5,41.5 18.5,41.5 22.5,37.5 22.5,31.45 U1.8
  Top 0.4: SJ3.1 13.5,37.8 14.69,38.98 Q1.4 15.07,40.23 R73.2
SPI_MISO
  Top 0.2: U1.14 37.81,32.53 35.91,34.43 35.91,38.79 34.54,40.16 IC4.1
SPI_MOSI
  Top 0.2: IC4.14 34.45,39.5 35.27,38.68 U1.13
SPI_SCK  (via drill 0.35)
  Top 0.2: IC4.13 33.3,38.5 33,38.8 v33,39.3 | U1.35 36.9,45.71 36.9,40.2 v36.25,39.55
  Bottom 0.2: v33,39.3 36,39.3 v36.25,39.55
VIN
  Bottom 0.25: C1.1 9,25.6 R1.1
  pour Bottom (no thermals): 3.45,13.65 0.55,13.65 0.55,25.4 1.85,26.7 4.35,26.7 4.65,27 4.65,29.5 5.3,30.15 10.25,30.15 10.25,23.9 10.15,23.8 10.15,22.7 8.95,22.7 8.95,23.6 7.9,24.65 7.9,25.05 7.65,25.3 6.75,25.3 5.45,24 2.3,24 1.95,23.65 1.95,21.05 2.7,20.3 2.7,15.8 3.45,15.05

## Text on the board
tPlace: BLADE | LLF | LRF | BLUETOOTH | EU_SENSOR | JSUMO_SENSOR | RoboManiacs | Sumo Board | LF | RF | FLAG | CANBUS | IMU | 24V | 5V | 3V3 | CLEAN | LB | RB | LLB | LRB
bPlace: S5 | S4 | S3 | S2 | S1 | S11 | S10 | S9 | S8 | S7 | S6 | ON-OFF | + | - | Designed by | VIN